# EAGLE design termo_placa (EAGLE 8.4.0)
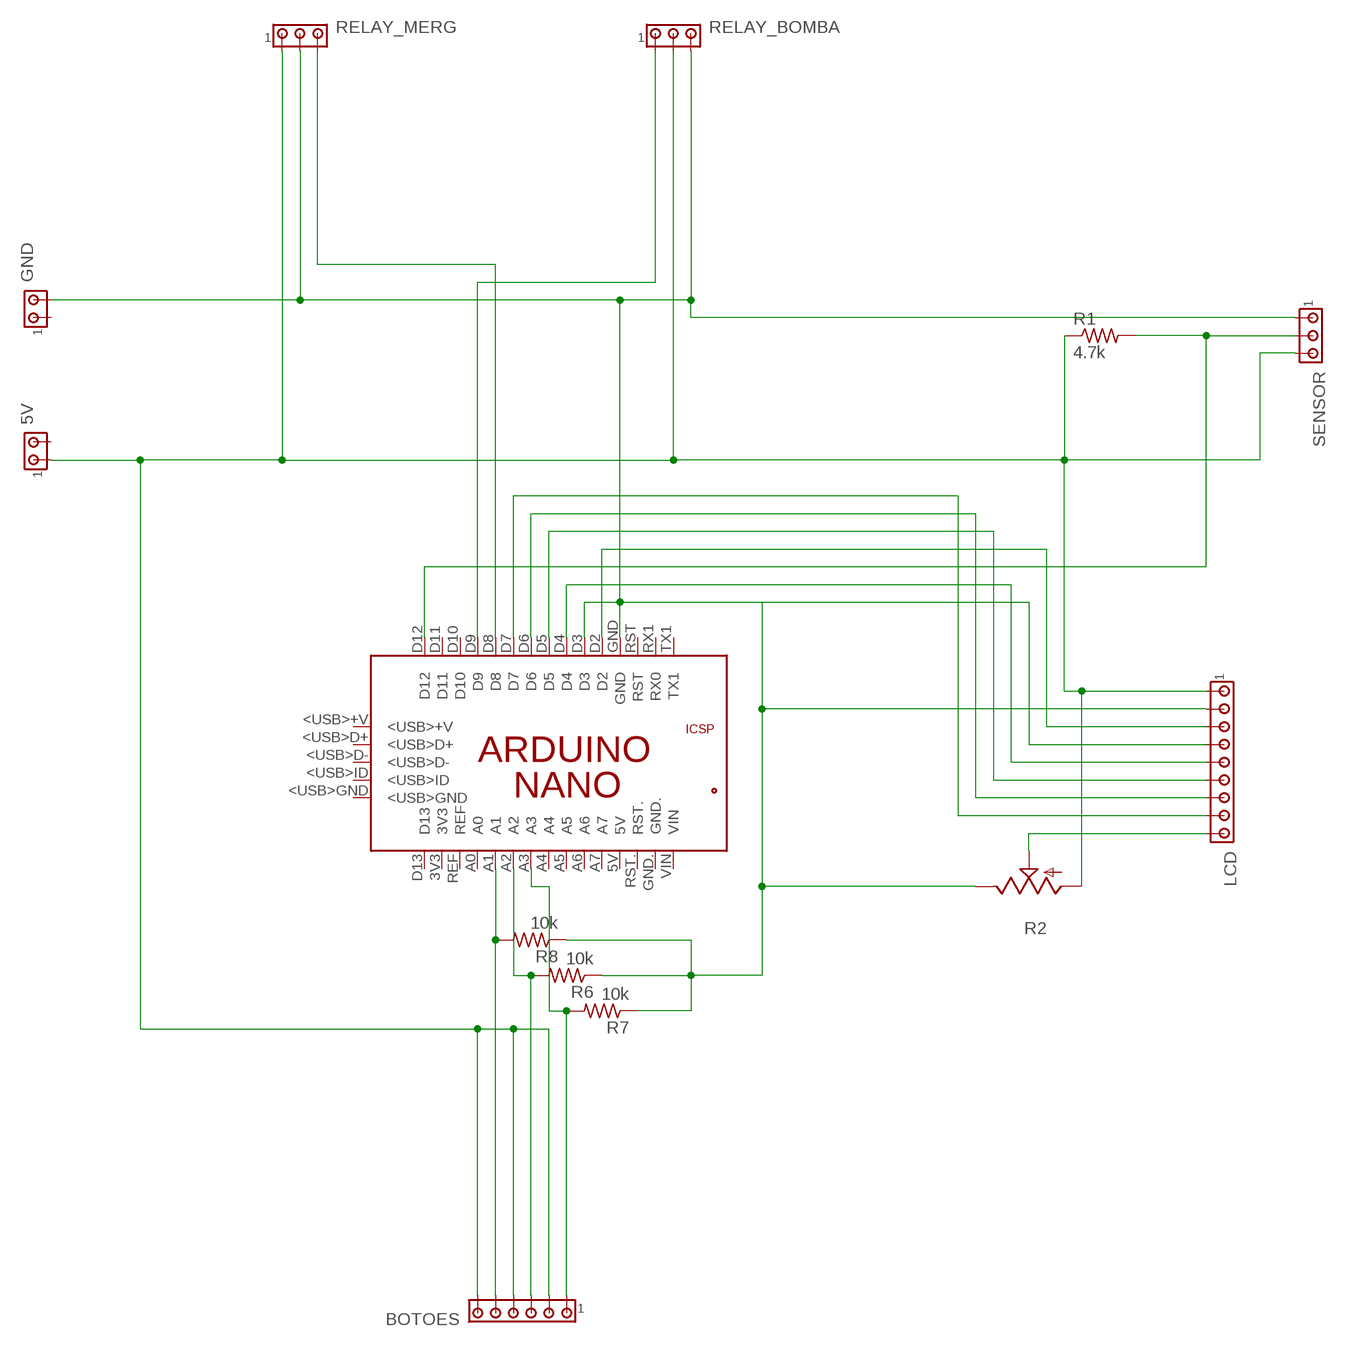
[diagram p0: schematic, sheet 1]

## Parts
5V  MTA02-156  [1X2MTA]
BOTOES  MTA06-156  [1X6MTA]
GND  MTA02-156  [1X2MTA]
LCD  MTA09-156  [1X9MTA]
PCB1  ARDUINO_NANO  [ARDUINO_NANO]
R1  4.7k  R-US_0204/7  [0204/7]
R2  TRIM_US-CA9V  [CA9V]
R6  10k  R-US_0204/7  [0204/7]
R7  10k  R-US_0204/7  [0204/7]
R8  10k  R-US_0204/7  [0204/7]
RELAY_BOMBA  MTA03-156  [1X3MTA]
RELAY_MERG  MTA03-156  [1X3MTA]
SENSOR  MTA03-100  [10X03MTA]

## Nets
N$1: GND.2 LCD.2 PCB1.GND R2.E R6.1 R7.1 RELAY_BOMBA.3 RELAY_MERG.2 SENSOR.1
N$2: 5V.1 BOTOES.2 BOTOES.4 BOTOES.6 LCD.1 R1.1 R2.A RELAY_BOMBA.2 RELAY_MERG.1 SENSOR.3
N$3: PCB1.D8 RELAY_MERG.3
N$4: PCB1.D9 RELAY_BOMBA.1
N$5: BOTOES.5 PCB1.A1 R8.2
N$6: PCB1.D12 R1.2 SENSOR.2
N$7: BOTOES.3 PCB1.A2 R6.2
N$8: BOTOES.1 PCB1.A3 R7.2
N$9: LCD.3 PCB1.D2
N$10: LCD.4 PCB1.D3
N$11: LCD.5 PCB1.D4
N$12: LCD.6 PCB1.D5
N$13: LCD.7 PCB1.D6
N$14: LCD.8 PCB1.D7
N$15: LCD.9 R2.S
Unconnected: 5V.2 GND.1 PCB1.3V3 PCB1.5V PCB1.5V. PCB1.<USB>+V PCB1.<USB>D+ PCB1.<USB>D- PCB1.<USB>GND PCB1.<USB>ID PCB1.A0 PCB1.A4 PCB1.A5 PCB1.A6 PCB1.A7 PCB1.D10 PCB1.D11 PCB1.D13 PCB1.GND. PCB1.GND_ PCB1.MISO PCB1.MOSI PCB1.REF PCB1.RESET.. PCB1.RST PCB1.RST. PCB1.RX1(RX0) PCB1.SCK PCB1.TX1 PCB1.VIN R8.1

## Library data of the parts
5V GND = con-amp:MTA02-156: AMP connector
BOTOES = con-amp:MTA06-156: AMP connector
LCD = con-amp:MTA09-156: AMP connector
PCB1 = E14_Arduino_revC:ARDUINO_NANO: Device for representing an Arduino Nano board with a footprint in an EAGLE design. Created by Dave Young for Element14. More EAGLE documentation at: http://www.element14.com/community/community/knode/cadsoft_eagle
R1 = rcl:R-US_: RESISTOR, American symbol
R2 = pot:TRIM_US-: POTENTIOMETER
R6-R8 = resistor:R-US_: RESISTOR, American symbol
RELAY_BOMBA RELAY_MERG = con-amp:MTA03-156: AMP connector
SENSOR = con-amp:MTA03-100: AMP connector

## Board
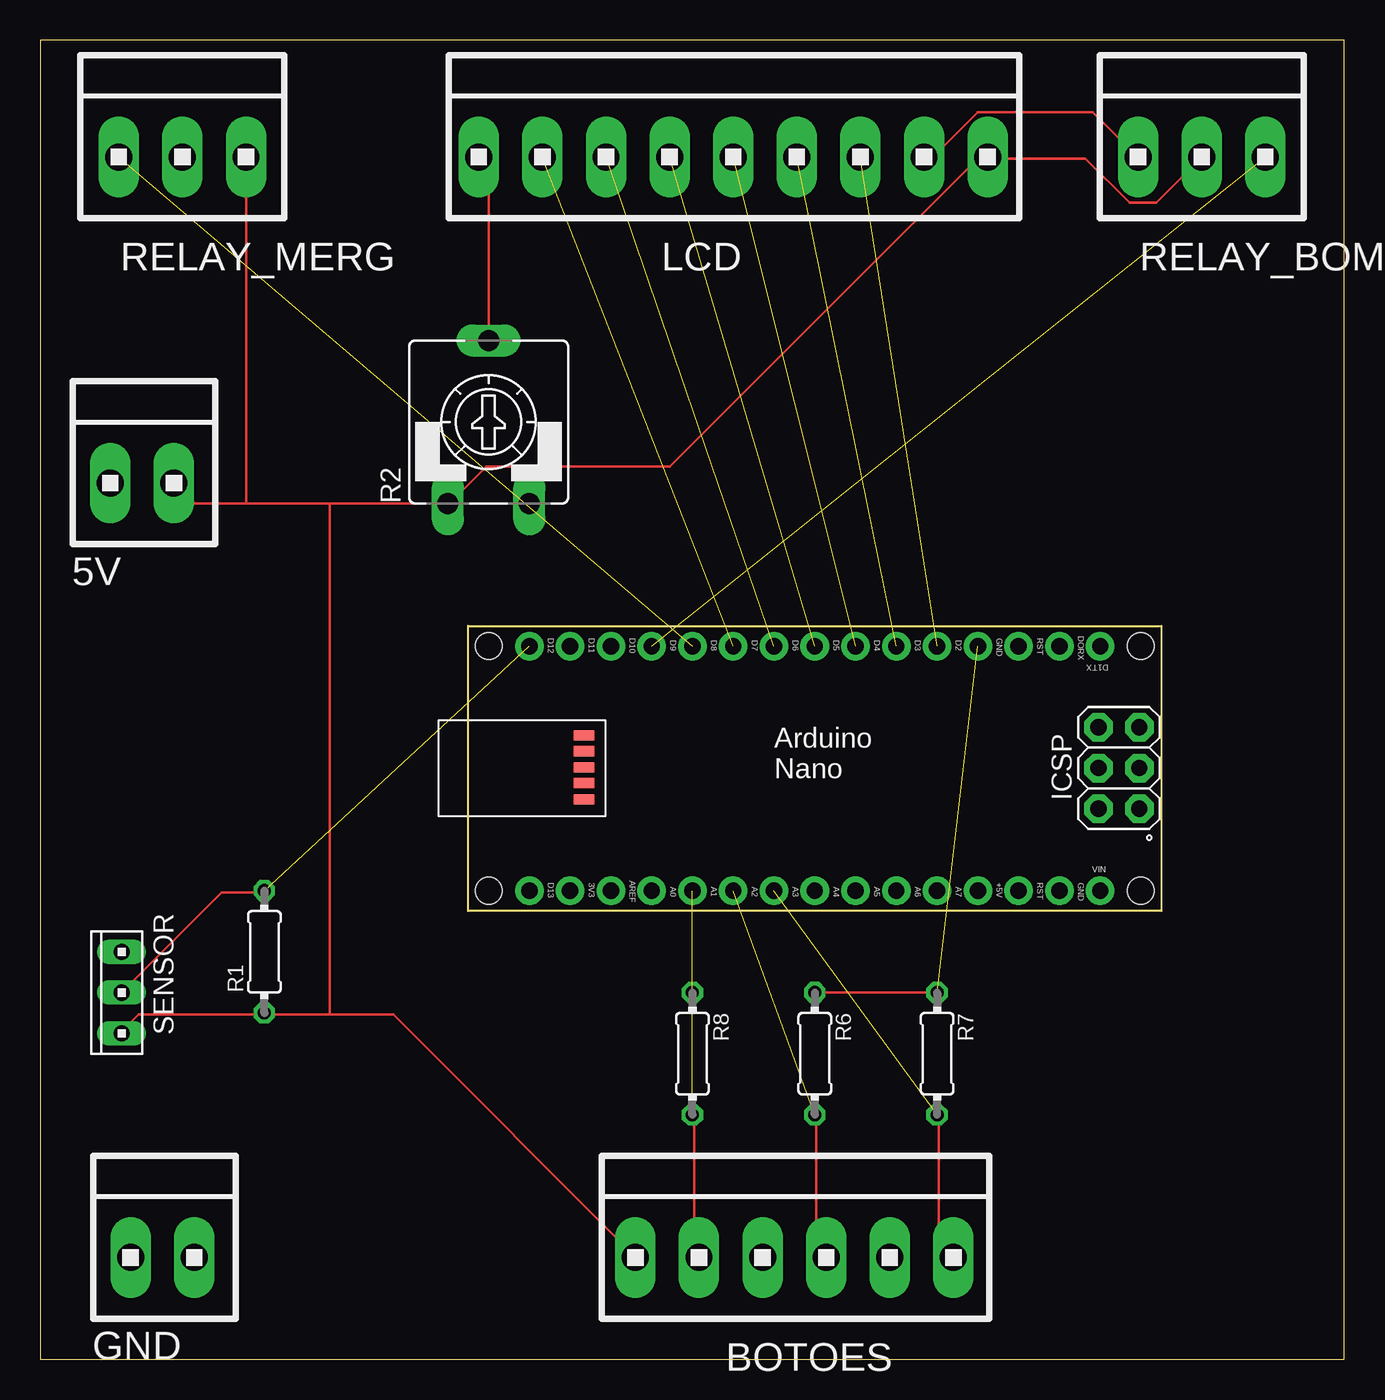
[diagram p1: board, top side]
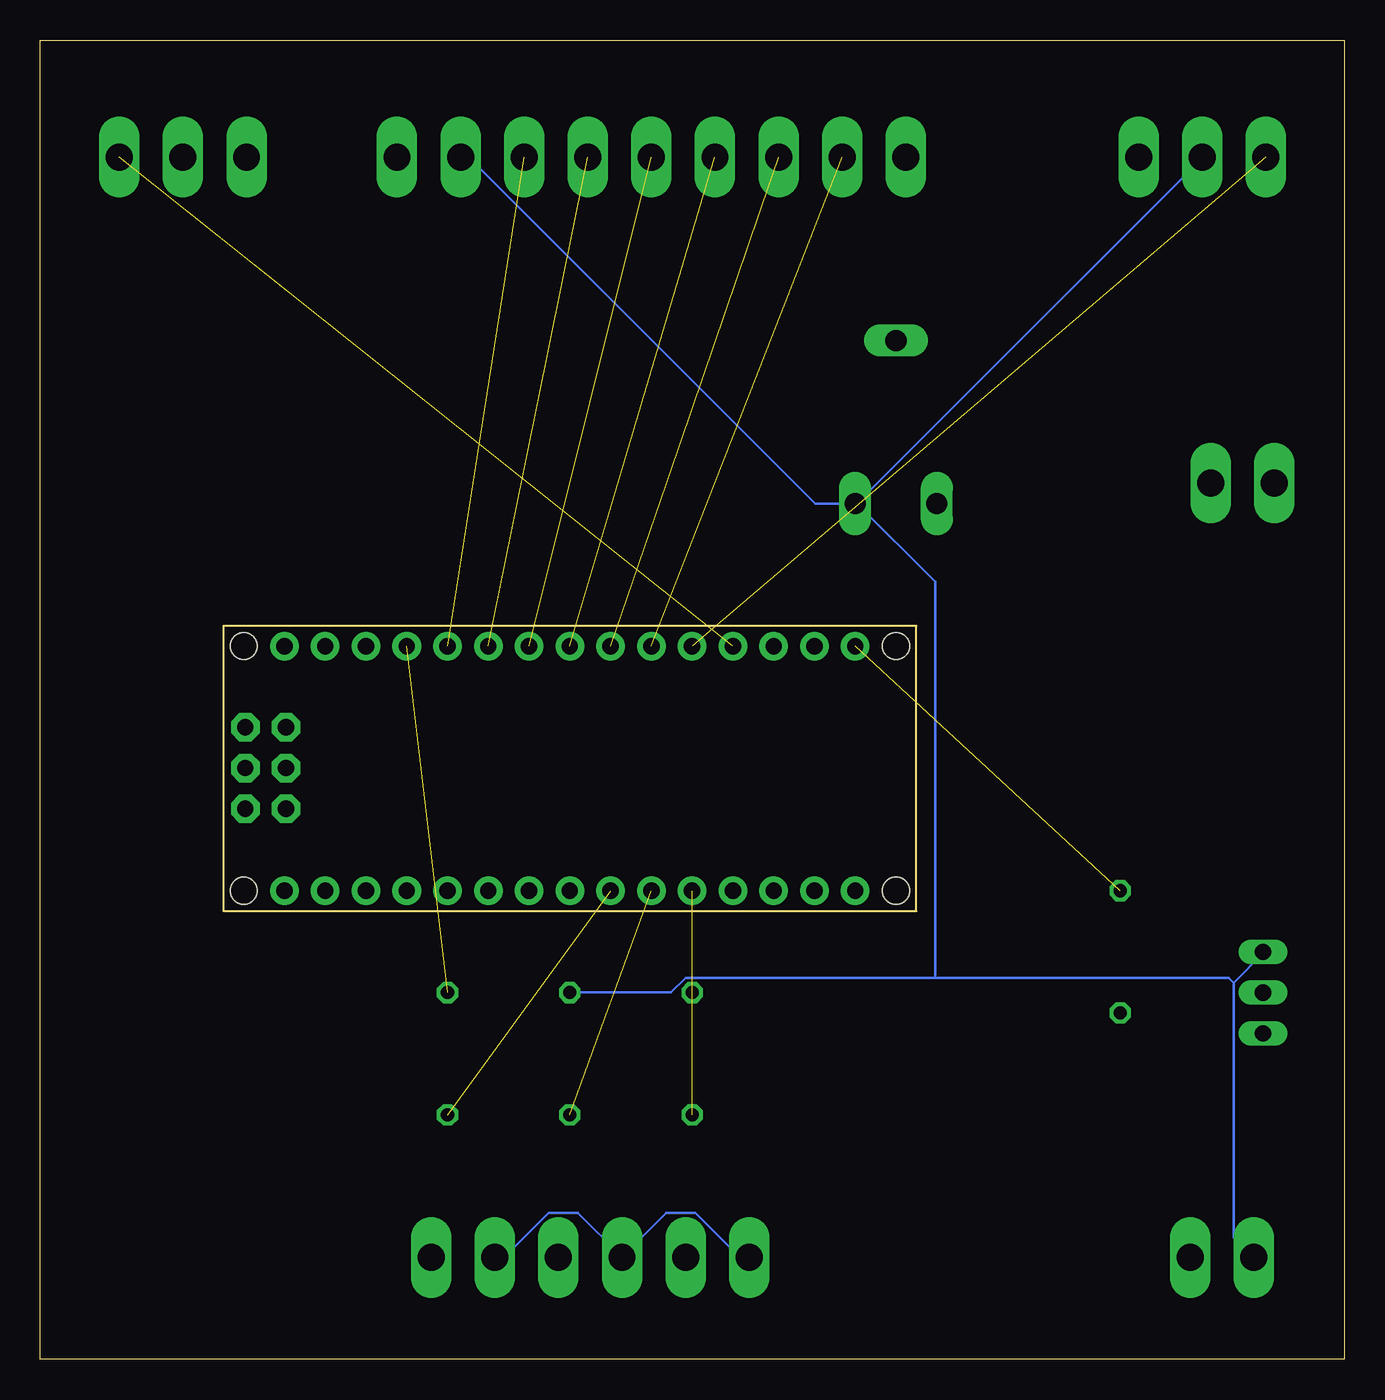
[diagram p2: board, bottom side, seen from below]

Size 81.26 x 82.22 mm. Coordinates in mm from the lower left corner, seen from the top.
Outline: 0,0 81.26,0 81.26,82.22 0,82.22 0,0
Copper layers (1*16): Top 0.035mm / dielectric 1.5mm / Bottom 0.035mm
Design rules "default": minimum track width 6mil, minimum drill 0.35mm, track to track 6mil, track to pad 6mil, pad to pad 6mil, via to via 6mil, smd to smd 6mil, copper to edge 40mil, drill to drill 6mil, minimum pad ring 10mil, minimum via ring 8mil, stop-mask expansion 4mil, vias tented up to drill 0mil, thermal gap 10mil

### Footprints (pad centres in the part's own frame; a part is rotated, then mirrored left to right if it is on the bottom)
1X2MTA = drill 1.676 long: 1 1.981,0; 2 -1.981,0
1X6MTA = drill 1.676 long: 1 9.906,0; 2 5.944,0; 3 1.981,0; 4 -1.981,0; 5 -5.944,0; 6 -9.906,0
1X9MTA = drill 1.676 long: 1 15.85,0; 2 11.887,0; 3 7.925,0; 4 3.962,0; 5 0,0; 6 -3.962,0; 7 -7.925,0; 8 -11.887,0; 9 -15.85,0
ARDUINO_NANO = drill 1.016 pad 1.778: 3V3 6.35,1.27; 5V 31.75,1.27; A0 11.43,1.27; A1 13.97,1.27; A2 16.51,1.27; A3 19.05,1.27; A4 21.59,1.27; A5 24.13,1.27; A6 26.67,1.27; A7 29.21,1.27; D2 29.21,16.51; D3 26.67,16.51; D4 24.13,16.51; D5 21.59,16.51; D6 19.05,16.51; D7 16.51,16.51; D8 13.97,16.51; D9 11.43,16.51; D10 8.89,16.51; D11 6.35,16.51; D12 3.81,16.51; D13 3.81,1.27; GND 31.75,16.51; GND. 36.83,1.27; REF 8.89,1.27; RST 34.29,16.51; RST. 34.29,1.27; RX1 36.83,16.51; TX1 39.37,16.51; VIN 39.37,1.27 | drill 1.016 pad 1.778 octagon: 5V. 39.268,6.375; GND_ 39.268,11.455; MISO 41.808,6.375; MOSI 39.268,8.915; RESET.. 41.808,11.455; SCK 41.808,8.915 | smd 1.27 x 0.635: <USB>+V 7.214,10.947; <USB>D+ 7.214,9.957; <USB>D- 7.214,8.941; <USB>GND 7.214,6.96; <USB>ID 7.214,7.976 | hole 1.651: 1.27,1.27; 1.27,16.51; 41.91,16.51; 41.91,1.27
0204/7 = drill 0.813 octagon: 1 -3.81,0; 2 3.81,0
CA9V = drill 1.321 long: A -2.54,-5.08; E 2.54,-5.08; S 0,5.08
1X3MTA = drill 1.676 long: 1 3.937,0; 2 -0.025,0; 3 -3.988,0
10X03MTA = drill 1.016 long: 1 2.54,0; 2 0,0; 3 -2.54,0

### Placement (x,y rotation side)
5V  6.35,54.61 0 top
BOTOES  46.99,6.35 0 top
GND  7.62,6.35 0 top
LCD  43.18,74.93 0 top
PCB1  26.67,27.94 0 top
R1  13.97,25.4 90 top
R2  27.94,58.42 0 top
R6  48.26,19.05 270 top
R7  55.88,19.05 270 top
R8  40.64,19.05 270 top
RELAY_BOMBA  72.39,74.93 0 top
RELAY_MERG  8.89,74.93 0 top
SENSOR  5.08,22.86 90 top

### Tracks (layer width: path | path; a pad name or v marks a point on that pad's centre or on a via)
N$1  (1 unrouted)
  Top 0.152: R7.1 R6.1 | LCD.2 55.07,74.98 55.68,74.98 58.42,77.72 65.58,77.72 68.33,74.98 RELAY_BOMBA.3
  Bottom 0.152: 6.91,23.47 5.08,25.3 SENSOR.1 | 6.91,23.47 6.91,7.62 GND.2 | R6.1 41.96,22.86 41.05,23.77 25.5,23.77 | 25.5,23.77 7.21,23.77 6.91,23.47 | 30.38,53.34 8.89,74.83 RELAY_MERG.2 | LCD.2 55.07,74.83 54.46,74.83 32.97,53.34 R2.E 30.38,53.34 | 25.5,23.77 25.5,48.46 30.38,53.34
N$2
  Top 0.152: SENSOR.3 5.08,20.42 6.15,21.49 13.92,21.49 R1.1 14.07,21.49 18.03,21.49 | 18.03,21.49 22,21.49 37.08,6.4 BOTOES.6 | 59.03,74.83 65.13,74.83 67.87,72.09 69.55,72.09 72.29,74.83 RELAY_BOMBA.2 | 12.85,53.34 9.65,53.34 8.43,54.56 5V.1 | 12.85,53.34 18.03,53.34 | 18.03,53.34 R2.A 25.5,53.34 27.79,55.63 39.22,55.63 58.42,74.83 59.03,74.83 | 12.85,53.34 12.85,74.83 RELAY_MERG.1 | 59.03,74.83 LCD.1 | 18.03,53.34 18.03,21.49
  Bottom 0.152: 45.01,6.4 42.27,9.14 40.44,9.14 37.69,6.4 37.08,6.4 BOTOES.6 | 45.01,6.4 47.75,9.14 49.58,9.14 52.32,6.4 52.93,6.4 BOTOES.2 | 45.01,6.4 BOTOES.4
N$3  (1 unrouted)
N$4  (1 unrouted)
N$5  (1 unrouted)
  Top 0.152: R8.2 40.74,15.24 40.74,6.71 41.05,6.4 BOTOES.5
N$6  (1 unrouted)
  Top 0.152: SENSOR.2 11.33,29.11 13.92,29.11 R1.2
N$7  (1 unrouted)
  Top 0.152: R6.2 48.36,15.24 48.36,7.01 48.97,6.4 BOTOES.3
N$8  (1 unrouted)
  Top 0.152: R7.2 55.98,15.24 55.98,7.32 56.9,6.4 BOTOES.1
N$9  (1 unrouted)
N$10  (1 unrouted)
N$11  (1 unrouted)
N$12  (1 unrouted)
N$13  (1 unrouted)
N$14  (1 unrouted)
N$15
  Top 0.152: R2.S 27.94,74.22 27.33,74.83 LCD.9